# Altium project 2026MM.PrjPcb (part 8 of 10)
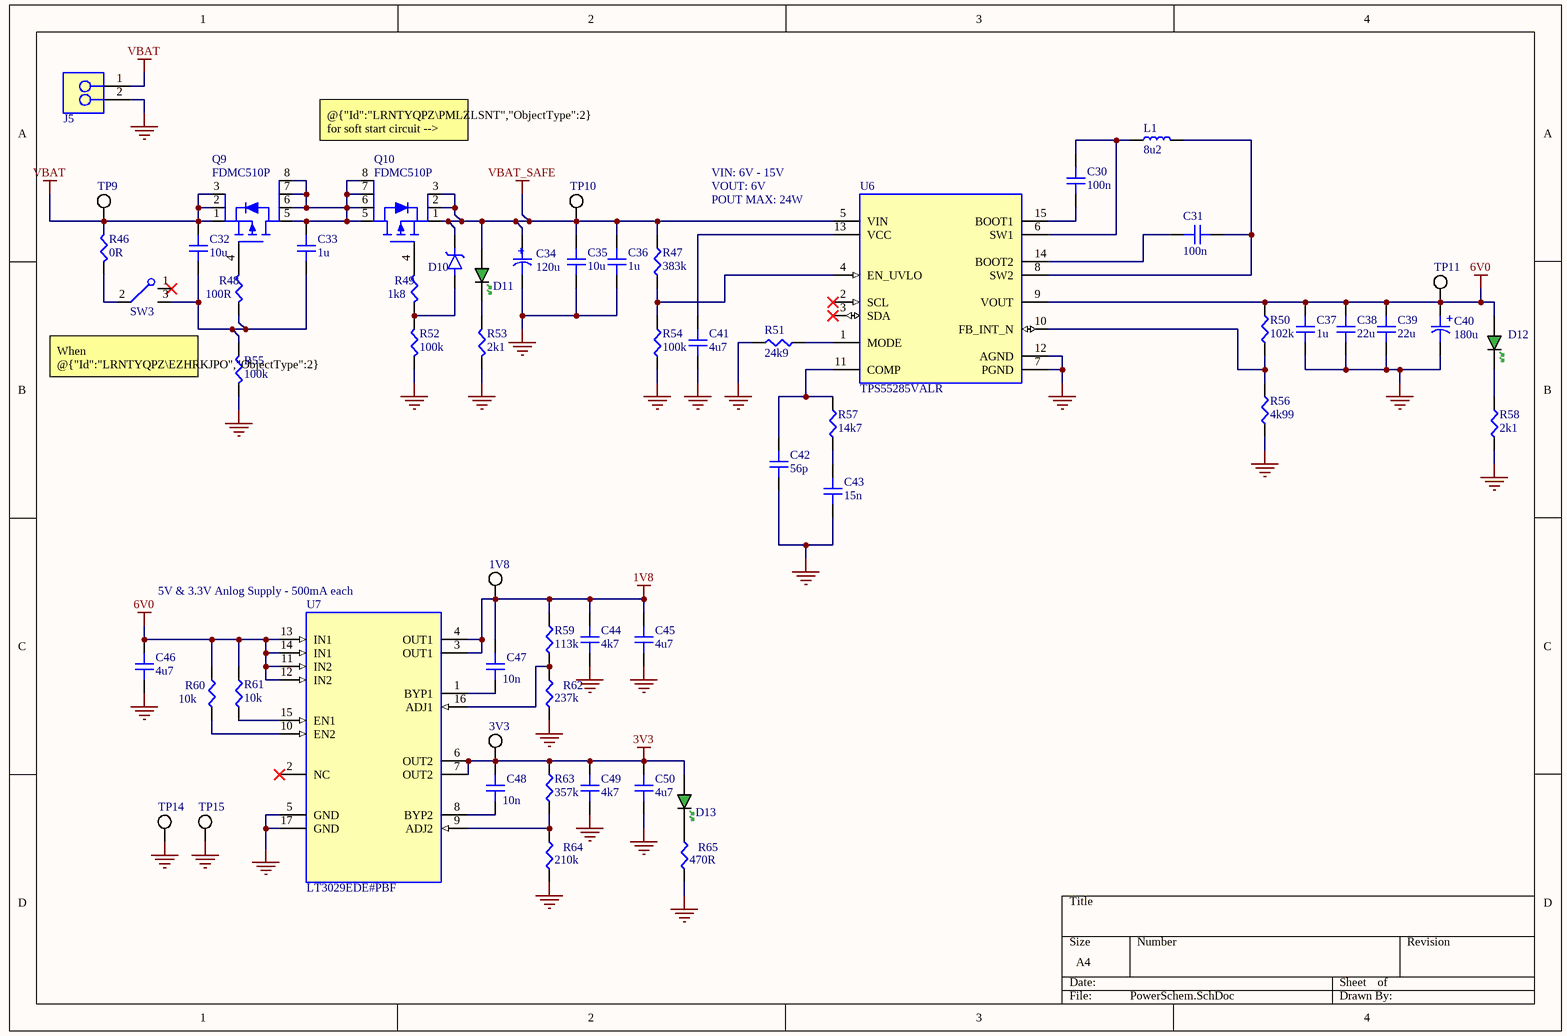
[diagram p8: PowerSchem.SchDoc]

## Sheet PowerSchem.SchDoc (continued)

### Library data of the parts (continued)
Q9 Q10 = PMOS: Single P-Channel 20 V 17 mOhm 116 nC 41 W PowerTrench SMT Mosfet - MLP-3.3x3.3; Manufacturer: onsemi; Manufacturer Lifecycle Status: ACTIVE; Continuous Drain Current (ID): 12A; Drain to Source Breakdown Voltage: -20V; Drain to Source Resistance: 8mΩ; Fall Time: 170ns; Gate to Source Voltage (Vgs): 8V; Input Capacitance: 7.86nF; Max Junction Temperature (Tj): 150°C; Max Power Dissipation: 41W; Min Breakdown Voltage: 20V; Number of Channels: 1; Power Dissipation: 2.3W; Rise Time: 34ns; Threshold Voltage: -500mV; Turn-Off Delay Time: 338ns; Turn-On Delay Time: 15ns; Supplier: Newark; Supplier Part Number: 55T6319; Manufacturer Part Number: FDMC510P; RoHS: Compliant; Category: MOSFETs; Stock: 2627; Pricing: 5=2.73, 10=1.88, 25=1.69, 50=1.49, 100=1.3, 250=1.19, 500=1.08, 1000=1.05 (USD); China RoHS: Compliant; Contact Plating: Gold; Drain to Source Voltage (Vdss): -20V; Element Configuration: Single; Height: 800µm; Length: 3.3mm; Lifecycle Status: Production; Max Operating Temperature: 150°C; Min Operating Temperature: -55°C; Mounting Technology: Surface Mount; Number of Elements: 1; Pins: 8; Number of Terminals: 5; Radiation Hardening: No; Rds On Max: 8mΩ; REACH SVHC: Yes; Schedule B: 8541290080, 8541290080|8541290080|8541290080|8541290080|8541290080; Weight: 165.33333mg; Width: 3.3mm; ComponentLink1URL: https://datasheet.octopart.com:443/FDMC510P-onsemi-datasheet-165728270.pdf?src-supplier=JRH+Electronics; ComponentLink1Description: https://datasheet.octopart.com:443/FDMC510P-onsemi-datasheet-165728270.pdf?src-supplier=JRH+Electronics; ComponentLink2URL: https://datasheet.octopart.com:443/FDMC510P-onsemi-datasheet-180959644.pdf?src-supplier=IHS; ComponentLink2Description: https://datasheet.octopart.com:443/FDMC510P-onsemi-datasheet-180959644.pdf?src-supplier=IHS; ComponentLink3URL: https://datasheet.octopart.com:443/FDMC510P-Fairchild-Semiconductor-datasheet-182289896.pdf?src-supplier=IHS; ComponentLink3Description: https://datasheet.octopart.com:443/FDMC510P-Fairchild-Semiconductor-datasheet-182289896.pdf?src-supplier=IHS; ComponentLink4URL: https://sigma.octopart.com:443/138897669/technical_drawing/onsemi-FDMC510P.pdf?src-supplier=Upverter; ComponentLink4Description: https://sigma.octopart.com:443/138897669/technical_drawing/onsemi-FDMC510P.pdf?src-supplier=Upverter; ComponentLink5URL: https://datasheet.octopart.com:443/FDMC510P-ON-Semiconductor-datasheet-98394445.pdf?src-supplier=Master+Electronics; ComponentLink5Description: https://datasheet.octopart.com:443/FDMC510P-ON-Semiconductor-datasheet-98394445.pdf?src-supplier=Master+Electronics; ComponentLink6URL: https://datasheet.octopart.com:443/FDMC510P-ON-Semiconductor-datasheet-85476435.pdf?src-supplier=onsemi; ComponentLink6Description: https://datasheet.octopart.com:443/FDMC510P-ON-Semiconductor-datasheet-85476435.pdf?src-supplier=onsemi; ComponentLink7URL: https://datasheet.octopart.com:443/FDMC510P-ON-Semiconductor-datasheet-86693097.pdf?src-supplier=onsemi; ComponentLink7Description: https://datasheet.octopart.com:443/FDMC510P-ON-Semiconductor-datasheet-86693097.pdf?src-supplier=onsemi; ComponentLink8URL: https://datasheet.octopart.com:443/FDMC510P-Fairchild-Semiconductor-datasheet-10853929.pdf?src-supplier=element14+APAC; ComponentLink8Description: https://datasheet.octopart.com:443/FDMC510P-Fairchild-Semiconductor-datasheet-10853929.pdf?src-supplier=element14+APAC; ComponentLink9URL: https://datasheet.octopart.com:443/FDMC510P-ON-Semiconductor-datasheet-86688170.pdf?src-supplier=element14+APAC; ComponentLink9Description: https://datasheet.octopart.com:443/FDMC510P-ON-Semiconductor-datasheet-86688170.pdf?src-supplier=element14+APAC; ComponentLink10URL: https://datasheet.octopart.com:443/FDMC510P-Fairchild-Semiconductor-datasheet-33026367.pdf?src-supplier=element14+APAC; ComponentLink10Description: https://datasheet.octopart.com:443/FDMC510P-Fairchild-Semiconductor-datasheet-33026367.pdf?src-supplier=element14+APAC; ComponentLink11URL: https://datasheet.octopart.com:443/FDMC510P-onsemi-datasheet-181958840.pdf?src-supplier=Newark; ComponentLink11Description: https://datasheet.octopart.com:443/FDMC510P-onsemi-datasheet-181958840.pdf?src-supplier=Newark; ComponentLink12URL: https://datasheet.octopart.com:443/FDMC510P-Fairchild-Semiconductor-datasheet-21199293.pdf?src-supplier=Newark; ComponentLink12Description: https://datasheet.octopart.com:443/FDMC510P-Fairchild-Semiconductor-datasheet-21199293.pdf?src-supplier=Newark; ComponentLink13URL: https://datasheet.octopart.com:443/FDMC510P-Fairchild-Semiconductor-datasheet-32852807.pdf?src-supplier=Newark; ComponentLink13Description: https://datasheet.octopart.com:443/FDMC510P-Fairchild-Semiconductor-datasheet-32852807.pdf?src-supplier=Newark; ComponentLink14URL: https://datasheet.octopart.com:443/FDMC510P-ON-Semiconductor-datasheet-33132503.pdf?src-supplier=Fairchild+Semiconductor; ComponentLink14Description: https://datasheet.octopart.com:443/FDMC510P-ON-Semiconductor-datasheet-33132503.pdf?src-supplier=Fairchild+Semiconductor; ComponentLink15URL: https://sigma.octopart.com:443/33130028/technical_drawing/Fairchild-Semiconductor-FDMC510P.pdf?src-supplier=Fairchild+Semiconductor; ComponentLink15Description: https://sigma.octopart.com:443/33130028/technical_drawing/Fairchild-Semiconductor-FDMC510P.pdf?src-supplier=Fairchild+Semiconductor; ComponentLink16URL: https://sigma.octopart.com:443/17347435/technical_drawing/Fairchild-Semiconductor-FDMC510P.pdf?src-supplier=Fairchild+Semiconductor; ComponentLink16Description: https://sigma.octopart.com:443/17347435/technical_drawing/Fairchild-Semiconductor-FDMC510P.pdf?src-supplier=Fairchild+Semiconductor; ComponentLink17URL: https://datasheet.octopart.com:443/FDMC510P-Fairchild-Semiconductor-datasheet-31665617.pdf?src-supplier=Farnell; ComponentLink17Description: https://datasheet.octopart.com:443/FDMC510P-Fairchild-Semiconductor-datasheet-31665617.pdf?src-supplier=Farnell; ComponentLink18URL: https://datasheet.octopart.com:443/FDMC510P-Fairchild-Semiconductor-datasheet-11793458.pdf?src-supplier=Arrow+Electronics; ComponentLink18Description: https://datasheet.octopart.com:443/FDMC510P-Fairchild-Semiconductor-datasheet-11793458.pdf?src-supplier=Arrow+Electronics; ComponentLink19URL: https://datasheet.octopart.com:443/FDMC510P-ON-Semiconductor-datasheet-130079718.pdf?src-supplier=TME; ComponentLink19Description: https://datasheet.octopart.com:443/FDMC510P-ON-Semiconductor-datasheet-130079718.pdf?src-supplier=TME; ComponentLink20URL: https://datasheet.octopart.com:443/FDMC510P-Fairchild-Semiconductor-datasheet-14042252.pdf?src-supplier=iiiC; ComponentLink20Description: https://datasheet.octopart.com:443/FDMC510P-Fairchild-Semiconductor-datasheet-14042252.pdf?src-supplier=iiiC; ComponentLink21URL: http://sigma.octopart.com:80/150608879/rohs_statement/ON-Semiconductor-FDMC510P.pdf?src-supplier=Compliance+Statements; ComponentLink21Description: http://sigma.octopart.com:80/150608879/rohs_statement/ON-Semiconductor-FDMC510P.pdf?src-supplier=Compliance+Statements; ComponentLink22URL: http://sigma.octopart.com:80/17347465/reach_statement/Fairchild-Semiconductor-FDMC510P.pdf?src-supplier=Compliance+Statements; ComponentLink22Description: http://sigma.octopart.com:80/17347465/reach_statement/Fairchild-Semiconductor-FDMC510P.pdf?src-supplier=Compliance+Statements; ComponentLink23URL: http://sigma.octopart.com:80/17347469/materials_sheet/Fairchild-Semiconductor-FDMC510P.pdf?src-supplier=Compliance+Statements; ComponentLink23Description: http://sigma.octopart.com:80/17347469/materials_sheet/Fairchild-Semiconductor-FDMC510P.pdf?src-supplier=Compliance+Statements; ComponentLink24URL: http://sigma.octopart.com:80/33132635/reach_statement/Fairchild-Semiconductor-FDMC510P.pdf?src-supplier=Compliance+Statements; ComponentLink24Description: http://sigma.octopart.com:80/33132635/reach_statement/Fairchild-Semiconductor-FDMC510P.pdf?src-supplier=Compliance+Statements; ComponentLink25URL: http://sigma.octopart.com:80/33132647/materials_sheet/Fairchild-Semiconductor-FDMC510P.pdf?src-supplier=Compliance+Statements; ComponentLink25Description: http://sigma.octopart.com:80/33132647/materials_sheet/Fairchild-Semiconductor-FDMC510P.pdf?src-supplier=Compliance+Statements; ComponentLink26URL: http://sigma.octopart.com:80/reach_statement/ON-Semiconductor-company-79.pdf?src-supplier=Compliance+Statements; ComponentLink26Description: http://sigma.octopart.com:80/reach_statement/ON-Semiconductor-company-79.pdf?src-supplier=Compliance+Statements; ComponentLink27URL: http://sigma.octopart.com:80/reach_statement/Fairchild-Semiconductor-company-9.pdf?src-supplier=Compliance+Statements; ComponentLink27Description: http://sigma.octopart.com:80/reach_statement/Fairchild-Semiconductor-company-9.pdf?src-supplier=Compliance+Statements; ComponentLink28URL: http://sigma.octopart.com:80/rohs_statement/Fairchild-Semiconductor-company-10.pdf?src-supplier=Compliance+Statements; ComponentLink28Description: http://sigma.octopart.com:80/rohs_statement/Fairchild-Semiconductor-company-10.pdf?src-supplier=Compliance+Statements; ComponentLink29URL: http://sigma.octopart.com:80/rohs_statement/Fairchild-Semiconductor-company-11.pdf?src-supplier=Compliance+Statements; ComponentLink29Description: http://sigma.octopart.com:80/rohs_statement/Fairchild-Semiconductor-company-11.pdf?src-supplier=Compliance+Statements; ComponentLink30URL: https://octopart.com:443/opatz8j6/c1?t=dVssBGCTMjMDuZ8LzfI9h-sCjmCv5fC98FaG_P8I69eWOln85ap1aE-Ca2bz-RAyN2ZXqR6przDzMpCE58kh4AJDHYDyR3EpiomfbbDlH4jXtrkNWaDVizcOiV7jmULHPFoYVJAH90Rx5QNsievqdckXrXmLYAFVonklUYXppuEPic276FdRbjc2zYru_rs1cSu4-6y02IakjByRH9wH7ES2BWSk7eA1NwGWHKQ1bgEFufbeIPnBRlFJ2r5lIWj5r9jzPV4HLpWTYrqG4y-Gwam281sC2yDMtqQo1L_Ous2VjI3XkGPB-LvVfIQiWMMSNC83OfJzuEA_eoibmu3f00fgEoipcTa800Bljw&src-supplier=Compliance+Statements; ComponentLink30Description: https://octopart.com:443/opatz8j6/c1?t=dVssBGCTMjMDuZ8LzfI9h-sCjmCv5fC98FaG_P8I69eWOln85ap1aE-Ca2bz-RAyN2ZXqR6przDzMpCE58kh4AJDHYDyR3EpiomfbbDlH4jXtrkNWaDVizcOiV7jmULHPFoYVJAH90Rx5QNsievqdckXrXmLYAFVonklUYXppuEPic276FdRbjc2zYru_rs1cSu4-6y02IakjByRH9wH7ES2BWSk7eA1NwGWHKQ1bgEFufbeIPnBRlFJ2r5lIWj5r9jzPV4HLpWTYrqG4y-Gwam281sC2yDMtqQo1L_Ous2VjI3XkGPB-LvVfIQiWMMSNC83OfJzuEA_eoibmu3f00fgEoipcTa800Bljw&src-supplier=Compliance+Statements; ComponentLink31URL: https://octopart.com:443/opatz8j6/c1?t=ur27FYyO6V6hX1TgMYtmm8OD-P2le7yUFyviZdag842a6RB6B76-HyNzzxTkr3DykXScWdfYvd_d4AuEORiF2Eg5UPIMXJzw-g1ysG48Pa3n2ew7j1Jol16yAbQYlqZfOOVG36Xa2ealcgWEbMkHsy38FXKcIwpMWyneeip2g_VuQ4pe9Hu33BoPR6pAOFWuZDzNMrc4ZUXwNbDIilaAB7qhgoqT1IlrvMfexiSRB7D8_MN69XK-sqE8U5E0iED-b6_M4yP2hG4xxVdhUblIYtUmVsbOoEUCM3MC6YkG10UWi5iEcPtPDOKVNw0cpfVpxKYIrSRS-220T8_vfQM613JpenGVWuGw0El1&src-supplier=Compliance+Statements; ComponentLink31Description: https://octopart.com:443/opatz8j6/c1?t=ur27FYyO6V6hX1TgMYtmm8OD-P2le7yUFyviZdag842a6RB6B76-HyNzzxTkr3DykXScWdfYvd_d4AuEORiF2Eg5UPIMXJzw-g1ysG48Pa3n2ew7j1Jol16yAbQYlqZfOOVG36Xa2ealcgWEbMkHsy38FXKcIwpMWyneeip2g_VuQ4pe9Hu33BoPR6pAOFWuZDzNMrc4ZUXwNbDIilaAB7qhgoqT1IlrvMfexiSRB7D8_MN69XK-sqE8U5E0iED-b6_M4yP2hG4xxVdhUblIYtUmVsbOoEUCM3MC6YkG10UWi5iEcPtPDOKVNw0cpfVpxKYIrSRS-220T8_vfQM613JpenGVWuGw0El1&src-supplier=Compliance+Statements; Supplier 1: Newark; Supplier Part Number 1: FDMC510P; Country of Origin: Thailand; Export Control Classification Number (ECCN) Code: EAR99; Introduction Date: 2010-05-19; ComponentLink32URL: https://octopart.com:443/opatz8j6/c1?t=RML8NUxsOD3zxQbLCG8hisxkZIMWN814d7TbImpILMRVzn674V32XSskTU4OpmrXR_F4c8XdCQhWM49aP13ECACXcxqgWHE-E8PlMICW5HechuJMk2pSs0e9rMmYu0YD-EiUNcRS0SwVh-bt5aJmjImXp9rfv5BjJi5oB7pKW6ijneoujgUEyPkNEhjf8nC2laKbe16OQmqFg_QBC8wyWOOSBmsIk6z1ll_is2cHUHx9HwPKEn_pOxfF08i0Zq1-2eWXrF4Fn-y5i3i5XSXygnw-VVhNUAEKeHZUfp77q22Ac852uuosVrhPrj7IIUecCxlsDZn6FyzrV2cOLnTUKkxkBaPb3k2QDqjkJg&src-supplier=Compliance+Statements; ComponentLink32Description: https://octopart.com:443/opatz8j6/c1?t=RML8NUxsOD3zxQbLCG8hisxkZIMWN814d7TbImpILMRVzn674V32XSskTU4OpmrXR_F4c8XdCQhWM49aP13ECACXcxqgWHE-E8PlMICW5HechuJMk2pSs0e9rMmYu0YD-EiUNcRS0SwVh-bt5aJmjImXp9rfv5BjJi5oB7pKW6ijneoujgUEyPkNEhjf8nC2laKbe16OQmqFg_QBC8wyWOOSBmsIk6z1ll_is2cHUHx9HwPKEn_pOxfF08i0Zq1-2eWXrF4Fn-y5i3i5XSXygnw-VVhNUAEKeHZUfp77q22Ac852uuosVrhPrj7IIUecCxlsDZn6FyzrV2cOLnTUKkxkBaPb3k2QDqjkJg&src-supplier=Compliance+Statements; ComponentLink33URL: https://octopart.com:443/opatz8j6/c1?t=ufmlkAmUS6MZ-17ePBarHbc93ydNq8eGZQ0uTxoTrkmQ1MRSwF9KwTFjFjAgo9HcFrtzUSnf1P65j3Lz7eGF6jydxYNGOEIsCBDujU0FsXFPnBJbOTeyY6oOK-w7douSgfiJmsVPw2G3MJ_qKT8i5rYQ4u-soB1E1yDKj1eKh3LO1RwFyk7iXLS9VOkvFPCESk-9Ns8-OSraXB-xNepBnO_lfd9606VBexn1tXLvRynW--i4ax44CvNnqKbAZxH82NP1VAut5zwmhlO-hYedaCK05bTQ7OkheYpxIzA2mC7ELajepPR_fPo26NaJh9t4Sgtxl9-c4nO_U8dely3pgMVGsf9i0vV64Hwf&src-supplier=Compliance+Statements; ComponentLink33Description: https://octopart.com:443/opatz8j6/c1?t=ufmlkAmUS6MZ-17ePBarHbc93ydNq8eGZQ0uTxoTrkmQ1MRSwF9KwTFjFjAgo9HcFrtzUSnf1P65j3Lz7eGF6jydxYNGOEIsCBDujU0FsXFPnBJbOTeyY6oOK-w7douSgfiJmsVPw2G3MJ_qKT8i5rYQ4u-soB1E1yDKj1eKh3LO1RwFyk7iXLS9VOkvFPCESk-9Ns8-OSraXB-xNepBnO_lfd9606VBexn1tXLvRynW--i4ax44CvNnqKbAZxH82NP1VAut5zwmhlO-hYedaCK05bTQ7OkheYpxIzA2mC7ELajepPR_fPo26NaJh9t4Sgtxl9-c4nO_U8dely3pgMVGsf9i0vV64Hwf&src-supplier=Compliance+Statements
R46 = RES: GENERAL PURPOSE CHIP RESISTOR Metal Glaze/thick Film, 0.1W, 0ohm, Surface Mount, 0603; Manufacturer: Yageo Group; Manufacturer Part Number: RC0603JR-070RL; Power Rating: 100mW; Temperature Coefficient: 200ppm/°C; Tolerance: 1%; Voltage Rating: 50V; Value: 0R; Supplier 1: Avnet; Supplier Part Number 1: RC0603JR-070RL; RoHS: Compliant; Category: Chip SMD Resistors; Stock: 1835000; Pricing: 5000=0.00139, 10000=0.00135, 20000=0.00131, 40000=0.00129, 80000=0.00126 (USD); Case/Package: 0603; Case Code (Imperial): 0603; China RoHS: Non-Compliant; Composition: Thick Film; Contact Plating: Tin; Country of Origin: Mainland China, Taiwan; Depth: 800µm; Export Control Classification Number (ECCN) Code: EAR99; Height: 450µm; Harmonized Tariff Schedule (HTS) Code: 8533.21.00.30; Introduction Date: 2001-06-08; Lead Free: Lead Free; Length: 1.6mm; Lifecycle Status: Production; Max Operating Temperature: 155°C; Military Standard: Not; Min Operating Temperature: -55°C; Mounting Technology: Surface Mount; Pins: 2; Number of Terminals: 2; Packaging: Cut Tape; Radiation Hardening: No; REACH SVHC: Yes; Termination: SMD/SMT; Voltage Rating (DC): 50V; Width: 800µm; ComponentLink1URL: https://datasheet.octopart.com:443/RC0603JR-070RL-Yageo-datasheet-182189538.pdf?src-supplier=IHS; ComponentLink1Description: https://datasheet.octopart.com:443/RC0603JR-070RL-Yageo-datasheet-182189538.pdf?src-supplier=IHS; ComponentLink2URL: https://datasheet.octopart.com:443/RC0603JR-070RL-Yageo-datasheet-8328172.pdf?src-supplier=element14+APAC; ComponentLink2Description: https://datasheet.octopart.com:443/RC0603JR-070RL-Yageo-datasheet-8328172.pdf?src-supplier=element14+APAC; ComponentLink3URL: https://datasheet.octopart.com:443/RC0603JR-070RL-Yageo-datasheet-17842380.pdf?src-supplier=element14+APAC; ComponentLink3Description: https://datasheet.octopart.com:443/RC0603JR-070RL-Yageo-datasheet-17842380.pdf?src-supplier=element14+APAC; ComponentLink4URL: https://datasheet.octopart.com:443/RC0603JR-070RL-Yageo-Group-datasheet-190305687.pdf?src-supplier=Newark; ComponentLink4Description: https://datasheet.octopart.com:443/RC0603JR-070RL-Yageo-Group-datasheet-190305687.pdf?src-supplier=Newark; ComponentLink5URL: https://datasheet.octopart.com:443/RC0603JR-070RL-Yageo-datasheet-12596169.pdf?src-supplier=Newark; ComponentLink5Description: https://datasheet.octopart.com:443/RC0603JR-070RL-Yageo-datasheet-12596169.pdf?src-supplier=Newark; ComponentLink6URL: https://datasheet.octopart.com:443/RC0603JR-070RL-Yageo-datasheet-34211833.pdf?src-supplier=Newark; ComponentLink6Description: https://datasheet.octopart.com:443/RC0603JR-070RL-Yageo-datasheet-34211833.pdf?src-supplier=Newark; ComponentLink7URL: https://datasheet.octopart.com:443/RC0603JR-070RL-Yageo-datasheet-62067350.pdf?src-supplier=Farnell; ComponentLink7Description: https://datasheet.octopart.com:443/RC0603JR-070RL-Yageo-datasheet-62067350.pdf?src-supplier=Farnell; ComponentLink8URL: https://datasheet.octopart.com:443/RC0603JR-070RL-Yageo-datasheet-15599030.pdf?src-supplier=Future+Electronics; ComponentLink8Description: https://datasheet.octopart.com:443/RC0603JR-070RL-Yageo-datasheet-15599030.pdf?src-supplier=Future+Electronics; ComponentLink9URL: https://datasheet.octopart.com:443/RC0603JR-070RL-Yageo-Group-datasheet-176638170.pdf?src-supplier=Future+Electronics; ComponentLink9Description: https://datasheet.octopart.com:443/RC0603JR-070RL-Yageo-Group-datasheet-176638170.pdf?src-supplier=Future+Electronics; ComponentLink10URL: https://datasheet.octopart.com:443/RC0603JR-070RL-Yageo-datasheet-164759695.pdf?src-supplier=Future+Electronics; ComponentLink10Description: https://datasheet.octopart.com:443/RC0603JR-070RL-Yageo-datasheet-164759695.pdf?src-supplier=Future+Electronics; ComponentLink11URL: https://datasheet.octopart.com:443/RC0603JR-070RL-Yageo-datasheet-137700087.pdf?src-supplier=Future+Electronics; ComponentLink11Description: https://datasheet.octopart.com:443/RC0603JR-070RL-Yageo-datasheet-137700087.pdf?src-supplier=Future+Electronics; ComponentLink12URL: https://datasheet.octopart.com:443/RC0603JR-070RL-Yageo-datasheet-27584510.pdf?src-supplier=Future+Electronics; ComponentLink12Description: https://datasheet.octopart.com:443/RC0603JR-070RL-Yageo-datasheet-27584510.pdf?src-supplier=Future+Electronics; ComponentLink13URL: https://datasheet.octopart.com:443/RC0603JR-070RL-Yageo-datasheet-503470.pdf?src-supplier=Future+Electronics; ComponentLink13Description: https://datasheet.octopart.com:443/RC0603JR-070RL-Yageo-datasheet-503470.pdf?src-supplier=Future+Electronics; ComponentLink14URL: https://datasheet.octopart.com:443/RC0603JR-070RL-Yageo-datasheet-79472498.pdf?src-supplier=Megastar; ComponentLink14Description: https://datasheet.octopart.com:443/RC0603JR-070RL-Yageo-datasheet-79472498.pdf?src-supplier=Megastar; ComponentLink15URL: https://datasheet.octopart.com/RC0603JR-070RL-Yageo-datasheet-73766026.pdf; ComponentLink15Description: https://datasheet.octopart.com/RC0603JR-070RL-Yageo-datasheet-73766026.pdf; ComponentLink16URL: https://datasheet.octopart.com:443/RC0603JR-070RL-Yageo-datasheet-5393049.pdf?src-supplier=element14; ComponentLink16Description: https://datasheet.octopart.com:443/RC0603JR-070RL-Yageo-datasheet-5393049.pdf?src-supplier=element14; ComponentLink17URL: https://datasheet.octopart.com:443/RC0603JR-070RL-Yageo-datasheet-118562.pdf?src-supplier=DigiKey; ComponentLink17Description: https://datasheet.octopart.com:443/RC0603JR-070RL-Yageo-datasheet-118562.pdf?src-supplier=DigiKey; ComponentLink18URL: http://sigma.octopart.com:80/conflict_mineral_statement/Yageo-company-3.pdf?src-supplier=Compliance+Statements; ComponentLink18Description: http://sigma.octopart.com:80/conflict_mineral_statement/Yageo-company-3.pdf?src-supplier=Compliance+Statements; ComponentLink19URL: http://sigma.octopart.com:80/rohs_statement/Yageo-company-2.pdf?src-supplier=Compliance+Statements; ComponentLink19Description: http://sigma.octopart.com:80/rohs_statement/Yageo-company-2.pdf?src-supplier=Compliance+Statements
R47 = RES: Res Thick Film 0603 383K Ohm 1% 0.1W(1/10W) ±100ppm/C Pad SMD T/R; Manufacturer: Yageo Group; Manufacturer Part Number: RC0603FR-07383KL; Max Power Dissipation: 100mW; Temperature Coefficient: 100ppm/°C; Voltage Rating: 75V; Voltage Rating (DC): 50V; Value: 383k; Supplier 1: Avnet; Supplier Part Number 1: 49AK2050; RoHS: Compliant; Category: Chip SMD Resistors; Stock: 1151; Pricing: 1=0.103, 25=0.006, 100=0.006 (USD); Case/Package: 0603; Case Code (Imperial): 0603; China RoHS: Non-Compliant; Composition: Thick Film; Country of Origin: Mainland China, Taiwan; Depth: 800µm; Export Control Classification Number (ECCN) Code: EAR99; Features: Moisture Resistant; Height: 450µm; Harmonized Tariff Schedule (HTS) Code: 8533.21.00.30; Introduction Date: 2004-09-22; Lead Free: Lead Free; Length: 1.6mm; Lifecycle Status: Production; Max Operating Temperature: 155°C; Military Standard: Not; Min Operating Temperature: -55°C; Mounting Technology: Surface Mount; Number of Terminals: 2; Number of Terminations: 2; Packaging: Tape & Reel; Power Rating: 100mW; REACH SVHC: Yes; Schedule B: 8533210045, 8533210045|8533210045, 8533210045|8533210045|8533210045, 8533210045|8533210045|8533210045|8533210045; Termination: SMD/SMT; Tolerance: 1%; Weight: 2.012816mg; Width: 800µm; Working Voltage: 75V; ComponentLink1URL: https://datasheet.octopart.com:443/RC0603FR-07383KL-Yageo-datasheet-175887523.pdf?src-supplier=Newark; ComponentLink1Description: https://datasheet.octopart.com:443/RC0603FR-07383KL-Yageo-datasheet-175887523.pdf?src-supplier=Newark; ComponentLink2URL: https://datasheet.octopart.com:443/RC0603FR-07383KL-Yageo-datasheet-103092701.pdf?src-supplier=Upverter; ComponentLink2Description: https://datasheet.octopart.com:443/RC0603FR-07383KL-Yageo-datasheet-103092701.pdf?src-supplier=Upverter; ComponentLink3URL: https://datasheet.octopart.com:443/RC0603FR-07383KL-Yageo-Group-datasheet-190305687.pdf?src-supplier=Future+Electronics; ComponentLink3Description: https://datasheet.octopart.com:443/RC0603FR-07383KL-Yageo-Group-datasheet-190305687.pdf?src-supplier=Future+Electronics; ComponentLink4URL: https://datasheet.octopart.com:443/RC0603FR-07383KL-Yageo-datasheet-164759695.pdf?src-supplier=Future+Electronics; ComponentLink4Description: https://datasheet.octopart.com:443/RC0603FR-07383KL-Yageo-datasheet-164759695.pdf?src-supplier=Future+Electronics; ComponentLink5URL: https://datasheet.octopart.com:443/RC0603FR-07383KL-Yageo-datasheet-137700087.pdf?src-supplier=Future+Electronics; ComponentLink5Description: https://datasheet.octopart.com:443/RC0603FR-07383KL-Yageo-datasheet-137700087.pdf?src-supplier=Future+Electronics; ComponentLink6URL: https://datasheet.octopart.com:443/RC0603FR-07383KL-Yageo-datasheet-27584510.pdf?src-supplier=Future+Electronics; ComponentLink6Description: https://datasheet.octopart.com:443/RC0603FR-07383KL-Yageo-datasheet-27584510.pdf?src-supplier=Future+Electronics; ComponentLink7URL: https://datasheet.octopart.com:443/RC0603FR-07383KL-Yageo-datasheet-15599030.pdf?src-supplier=Future+Electronics; ComponentLink7Description: https://datasheet.octopart.com:443/RC0603FR-07383KL-Yageo-datasheet-15599030.pdf?src-supplier=Future+Electronics; ComponentLink8URL: https://datasheet.octopart.com:443/RC0603FR-07383KL-Yageo-datasheet-12596169.pdf?src-supplier=Future+Electronics; ComponentLink8Description: https://datasheet.octopart.com:443/RC0603FR-07383KL-Yageo-datasheet-12596169.pdf?src-supplier=Future+Electronics; ComponentLink9URL: https://datasheet.octopart.com:443/RC0603FR-07383KL-Yageo-datasheet-8328172.pdf?src-supplier=Future+Electronics; ComponentLink9Description: https://datasheet.octopart.com:443/RC0603FR-07383KL-Yageo-datasheet-8328172.pdf?src-supplier=Future+Electronics; ComponentLink10URL: https://datasheet.octopart.com:443/RC0603FR-07383KL-Yageo-Group-datasheet-189192902.pdf?src-supplier=TME; ComponentLink10Description: https://datasheet.octopart.com:443/RC0603FR-07383KL-Yageo-Group-datasheet-189192902.pdf?src-supplier=TME; ComponentLink11URL: https://datasheet.octopart.com:443/RC0603FR-07383KL-Yageo-Group-datasheet-176638170.pdf?src-supplier=TME; ComponentLink11Description: https://datasheet.octopart.com:443/RC0603FR-07383KL-Yageo-Group-datasheet-176638170.pdf?src-supplier=TME; ComponentLink12URL: https://datasheet.octopart.com/RC0603FR-07383KL-Yageo-datasheet-73766026.pdf; ComponentLink12Description: https://datasheet.octopart.com/RC0603FR-07383KL-Yageo-datasheet-73766026.pdf; ComponentLink13URL: https://datasheet.octopart.com:443/RC0603FR-07383KL-Yageo-datasheet-118562.pdf?src-supplier=DigiKey; ComponentLink13Description: https://datasheet.octopart.com:443/RC0603FR-07383KL-Yageo-datasheet-118562.pdf?src-supplier=DigiKey; ComponentLink14URL: http://sigma.octopart.com:80/conflict_mineral_statement/Yageo-company-3.pdf?src-supplier=Compliance+Statements; ComponentLink14Description: http://sigma.octopart.com:80/conflict_mineral_statement/Yageo-company-3.pdf?src-supplier=Compliance+Statements; ComponentLink15URL: http://sigma.octopart.com:80/rohs_statement/Yageo-company-2.pdf?src-supplier=Compliance+Statements; ComponentLink15Description: http://sigma.octopart.com:80/rohs_statement/Yageo-company-2.pdf?src-supplier=Compliance+Statements
R48 = RES: Yageo RC0603FR-07100RL 0603 SMD Resistor 100 Ohm thin film chip resistor; Manufacturer: Yageo Group; Power Rating: 100mW; Temperature Coefficient: 100ppm/°C; Tolerance: 1%; Voltage Rating: 75V; Voltage Rating (DC): 50V; Value: 100R; Supplier 1: Avnet; Supplier Part Number 1: RC0603FR-07100RL; Manufacturer Part Number: RC0603FR-07100RL; RoHS: Compliant; Category: Chip SMD Resistors; Stock: 2960000; Pricing: 5000=0.00137, 10000=0.00137, 20000=0.00136, 40000=0.00135, 80000=0.00134 (USD); Case/Package: 0603; Case Code (Imperial): 0603; Case Code (Metric): 0603; China RoHS: Non-Compliant; Composition: Thick Film; Contact Plating: Tin; Depth: 800µm; Height: 450µm; Lead Free: Lead Free; Length: 1.6mm; Lifecycle Status: Production; Max Operating Temperature: 155°C; Military Standard: Not; Min Operating Temperature: -55°C; Mounting Technology: Surface Mount; Pins: 2; Number of Terminals: 2; Packaging: Cut Tape (CT); Radiation Hardening: No; REACH SVHC: Yes; Schedule B: 8533210045, 8533210045|8533210045|8533210045|8533210045|8533210045|8533210045|8533210045|8533210045|8533210045|8533210045|8533210045|8533210045|8533210045|8533210045|8533210045|8533210045|8533210045|8533210045|8533210045|8533210045|8533210045|8533210045|8533210045|85; Termination: SMD/SMT; Width: 800µm; Working Voltage: 75V; ComponentLink1URL: https://datasheet.octopart.com:443/RC0603FR-07100RL-Yageo-datasheet-175887523.pdf?src-supplier=IHS; ComponentLink1Description: https://datasheet.octopart.com:443/RC0603FR-07100RL-Yageo-datasheet-175887523.pdf?src-supplier=IHS; ComponentLink2URL: https://datasheet.octopart.com:443/RC0603FR-07100RL-Yageo-datasheet-8328172.pdf?src-supplier=Newark; ComponentLink2Description: https://datasheet.octopart.com:443/RC0603FR-07100RL-Yageo-datasheet-8328172.pdf?src-supplier=Newark; ComponentLink3URL: https://datasheet.octopart.com:443/RC0603FR-07100RL-Yageo-datasheet-34211833.pdf?src-supplier=Newark; ComponentLink3Description: https://datasheet.octopart.com:443/RC0603FR-07100RL-Yageo-datasheet-34211833.pdf?src-supplier=Newark; ComponentLink4URL: https://datasheet.octopart.com:443/RC0603FR-07100RL-Yageo-datasheet-103092701.pdf?src-supplier=Upverter; ComponentLink4Description: https://datasheet.octopart.com:443/RC0603FR-07100RL-Yageo-datasheet-103092701.pdf?src-supplier=Upverter; ComponentLink5URL: https://datasheet.octopart.com:443/RC0603FR-07100RL-Yageo-datasheet-62067350.pdf?src-supplier=element14+APAC; ComponentLink5Description: https://datasheet.octopart.com:443/RC0603FR-07100RL-Yageo-datasheet-62067350.pdf?src-supplier=element14+APAC; ComponentLink6URL: https://datasheet.octopart.com:443/RC0603FR-07100RL-Yageo-datasheet-17842380.pdf?src-supplier=element14+APAC; ComponentLink6Description: https://datasheet.octopart.com:443/RC0603FR-07100RL-Yageo-datasheet-17842380.pdf?src-supplier=element14+APAC; ComponentLink7URL: https://datasheet.octopart.com:443/RC0603FR-07100RL-Yageo-datasheet-12596169.pdf?src-supplier=Future+Electronics; ComponentLink7Description: https://datasheet.octopart.com:443/RC0603FR-07100RL-Yageo-datasheet-12596169.pdf?src-supplier=Future+Electronics; ComponentLink8URL: https://datasheet.octopart.com:443/RC0603FR-07100RL-Yageo-Group-datasheet-176638170.pdf?src-supplier=Future+Electronics; ComponentLink8Description: https://datasheet.octopart.com:443/RC0603FR-07100RL-Yageo-Group-datasheet-176638170.pdf?src-supplier=Future+Electronics; ComponentLink9URL: https://datasheet.octopart.com:443/RC0603FR-07100RL-Yageo-datasheet-164759695.pdf?src-supplier=Future+Electronics; ComponentLink9Description: https://datasheet.octopart.com:443/RC0603FR-07100RL-Yageo-datasheet-164759695.pdf?src-supplier=Future+Electronics; ComponentLink10URL: https://datasheet.octopart.com:443/RC0603FR-07100RL-Yageo-datasheet-137700087.pdf?src-supplier=Future+Electronics; ComponentLink10Description: https://datasheet.octopart.com:443/RC0603FR-07100RL-Yageo-datasheet-137700087.pdf?src-supplier=Future+Electronics; ComponentLink11URL: https://datasheet.octopart.com:443/RC0603FR07100RL-Yageo-datasheet-27584510.pdf?src-supplier=Future+Electronics; ComponentLink11Description: https://datasheet.octopart.com:443/RC0603FR07100RL-Yageo-datasheet-27584510.pdf?src-supplier=Future+Electronics; ComponentLink12URL: https://datasheet.octopart.com:443/RC0603FR-07100RL-Yageo-datasheet-15599030.pdf?src-supplier=Future+Electronics; ComponentLink12Description: https://datasheet.octopart.com:443/RC0603FR-07100RL-Yageo-datasheet-15599030.pdf?src-supplier=Future+Electronics; ComponentLink13URL: https://datasheet.octopart.com:443/RC0603FR-07100RL-Yageo-datasheet-8324193.pdf?src-supplier=Future+Electronics; ComponentLink13Description: https://datasheet.octopart.com:443/RC0603FR-07100RL-Yageo-datasheet-8324193.pdf?src-supplier=Future+Electronics; ComponentLink14URL: https://datasheet.octopart.com:443/RC0603FR-07100RL-Yageo-datasheet-79472498.pdf?src-supplier=Megastar; ComponentLink14Description: https://datasheet.octopart.com:443/RC0603FR-07100RL-Yageo-datasheet-79472498.pdf?src-supplier=Megastar; ComponentLink15URL: https://datasheet.octopart.com/RC0603FR-07100RL-Yageo-datasheet-73766026.pdf; ComponentLink15Description: https://datasheet.octopart.com/RC0603FR-07100RL-Yageo-datasheet-73766026.pdf; ComponentLink16URL: https://datasheet.octopart.com:443/RC0603FR-07100RL-Yageo-datasheet-13691069.pdf?src-supplier=Farnell; ComponentLink16Description: https://datasheet.octopart.com:443/RC0603FR-07100RL-Yageo-datasheet-13691069.pdf?src-supplier=Farnell; ComponentLink17URL: https://datasheet.octopart.com:443/RC0603FR-07100RL-Yageo-datasheet-118562.pdf?src-supplier=DigiKey; ComponentLink17Description: https://datasheet.octopart.com:443/RC0603FR-07100RL-Yageo-datasheet-118562.pdf?src-supplier=DigiKey; ComponentLink18URL: http://sigma.octopart.com:80/conflict_mineral_statement/Yageo-company-3.pdf?src-supplier=Compliance+Statements; ComponentLink18Description: http://sigma.octopart.com:80/conflict_mineral_statement/Yageo-company-3.pdf?src-supplier=Compliance+Statements; ComponentLink19URL: http://sigma.octopart.com:80/rohs_statement/Yageo-company-2.pdf?src-supplier=Compliance+Statements; ComponentLink19Description: http://sigma.octopart.com:80/rohs_statement/Yageo-company-2.pdf?src-supplier=Compliance+Statements
R49 = RES: General Purpose Chip Resistors RC0603 Rohs Compliant | Res SMD 1.8K Ohm 1% 1/10W 0603; Manufacturer: Yageo Group; Manufacturer Part Number: RC0603FR-071K8L; Max Power Dissipation: 100mW; Temperature Coefficient: 100ppm/°C; Voltage Rating: 75V; Voltage Rating (AC): 50V; Value: 1k8; Supplier 1: Avnet; Supplier Part Number 1: RC0603FR-071K8L; RoHS: Compliant; Category: Chip SMD Resistors; Stock: 485000; Pricing: 5000=0.00137, 10000=0.00137, 20000=0.00136, 40000=0.00135, 80000=0.00134 (USD); Case/Package: 0603; Case Code (Imperial): 0603; China RoHS: Non-Compliant; Composition: Thick Film; Contact Plating: Tin; Depth: 800µm; Features: Moisture Resistant; Height: 450µm; Lead Free: Lead Free; Length: 1.6mm; Lifecycle Status: Production; Max Operating Temperature: 155°C; Military Standard: Not; Min Operating Temperature: -55°C; Mounting Technology: Surface Mount; Pins: 2; Number of Terminals: 2; Number of Terminations: 2; Packaging: Cut Tape; Power Rating: 100mW; Radiation Hardening: No; REACH SVHC: Yes; Schedule B: 8533210045, 8533210045|8533210045, 8533210045|8533210045|8533210045, 8533210045|8533210045|8533210045|8533210045; Termination: SMD/SMT; Tolerance: 1%; Voltage Rating (DC): 50V; Width: 800µm; Working Voltage: 75V; ComponentLink1URL: https://datasheet.octopart.com:443/RC0603FR-071K8L-Yageo-datasheet-175887523.pdf?src-supplier=IHS; ComponentLink1Description: https://datasheet.octopart.com:443/RC0603FR-071K8L-Yageo-datasheet-175887523.pdf?src-supplier=IHS; ComponentLink2URL: https://datasheet.octopart.com:443/RC0603FR-071K8L-Yageo-datasheet-141265859.pdf?src-supplier=Upverter; ComponentLink2Description: https://datasheet.octopart.com:443/RC0603FR-071K8L-Yageo-datasheet-141265859.pdf?src-supplier=Upverter; ComponentLink3URL: https://datasheet.octopart.com:443/RC0603FR-071K8L-Yageo-datasheet-103092701.pdf?src-supplier=Upverter; ComponentLink3Description: https://datasheet.octopart.com:443/RC0603FR-071K8L-Yageo-datasheet-103092701.pdf?src-supplier=Upverter; ComponentLink4URL: https://datasheet.octopart.com:443/RC0603FR-071K8L-Yageo-Group-datasheet-190305687.pdf?src-supplier=Future+Electronics; ComponentLink4Description: https://datasheet.octopart.com:443/RC0603FR-071K8L-Yageo-Group-datasheet-190305687.pdf?src-supplier=Future+Electronics; ComponentLink5URL: https://datasheet.octopart.com:443/RC0603FR-071K8L-Yageo-datasheet-164759695.pdf?src-supplier=Future+Electronics; ComponentLink5Description: https://datasheet.octopart.com:443/RC0603FR-071K8L-Yageo-datasheet-164759695.pdf?src-supplier=Future+Electronics; ComponentLink6URL: https://datasheet.octopart.com:443/RC0603FR-071K8L-Yageo-datasheet-137700087.pdf?src-supplier=Future+Electronics; ComponentLink6Description: https://datasheet.octopart.com:443/RC0603FR-071K8L-Yageo-datasheet-137700087.pdf?src-supplier=Future+Electronics; ComponentLink7URL: https://datasheet.octopart.com:443/RC0603FR-071K8L-Yageo-datasheet-27584510.pdf?src-supplier=Future+Electronics; ComponentLink7Description: https://datasheet.octopart.com:443/RC0603FR-071K8L-Yageo-datasheet-27584510.pdf?src-supplier=Future+Electronics; ComponentLink8URL: https://datasheet.octopart.com:443/RC0603FR-071K8L-Yageo-datasheet-15599030.pdf?src-supplier=Future+Electronics; ComponentLink8Description: https://datasheet.octopart.com:443/RC0603FR-071K8L-Yageo-datasheet-15599030.pdf?src-supplier=Future+Electronics; ComponentLink9URL: https://datasheet.octopart.com:443/RC0603FR-071K8L-Yageo-datasheet-12596169.pdf?src-supplier=Future+Electronics; ComponentLink9Description: https://datasheet.octopart.com:443/RC0603FR-071K8L-Yageo-datasheet-12596169.pdf?src-supplier=Future+Electronics; ComponentLink10URL: https://datasheet.octopart.com:443/RC0603FR-071K8L-Yageo-datasheet-8324193.pdf?src-supplier=Future+Electronics; ComponentLink10Description: https://datasheet.octopart.com:443/RC0603FR-071K8L-Yageo-datasheet-8324193.pdf?src-supplier=Future+Electronics; ComponentLink11URL: https://datasheet.octopart.com:443/RC0603FR-071K8L-Yageo-datasheet-8328172.pdf?src-supplier=Newark; ComponentLink11Description: https://datasheet.octopart.com:443/RC0603FR-071K8L-Yageo-datasheet-8328172.pdf?src-supplier=Newark; ComponentLink12URL: https://datasheet.octopart.com:443/RC0603FR-071K8L-Yageo-datasheet-62067350.pdf?src-supplier=Newark; ComponentLink12Description: https://datasheet.octopart.com:443/RC0603FR-071K8L-Yageo-datasheet-62067350.pdf?src-supplier=Newark; ComponentLink13URL: https://datasheet.octopart.com:443/RC0603FR-071K8L-Yageo-Group-datasheet-176638170.pdf?src-supplier=Newark; ComponentLink13Description: https://datasheet.octopart.com:443/RC0603FR-071K8L-Yageo-Group-datasheet-176638170.pdf?src-supplier=Newark; ComponentLink14URL: https://datasheet.octopart.com:443/RC0603FR-071K8L-Yageo-datasheet-34211833.pdf?src-supplier=Farnell; ComponentLink14Description: https://datasheet.octopart.com:443/RC0603FR-071K8L-Yageo-datasheet-34211833.pdf?src-supplier=Farnell; ComponentLink15URL: https://datasheet.octopart.com:443/RC0603FR-071K8L-Yageo-datasheet-148775077.pdf?src-supplier=TME; ComponentLink15Description: https://datasheet.octopart.com:443/RC0603FR-071K8L-Yageo-datasheet-148775077.pdf?src-supplier=TME; ComponentLink16URL: https://datasheet.octopart.com:443/RC0603FR-071K8L-Yageo-datasheet-79472498.pdf?src-supplier=Megastar; ComponentLink16Description: https://datasheet.octopart.com:443/RC0603FR-071K8L-Yageo-datasheet-79472498.pdf?src-supplier=Megastar; ComponentLink17URL: https://datasheet.octopart.com/RC0603FR-071K8L-Yageo-datasheet-73766026.pdf; ComponentLink17Description: https://datasheet.octopart.com/RC0603FR-071K8L-Yageo-datasheet-73766026.pdf; ComponentLink18URL: https://datasheet.octopart.com:443/RC0603FR-071K8L-Yageo-datasheet-30459151.pdf?src-supplier=Seeed+Studio; ComponentLink18Description: https://datasheet.octopart.com:443/RC0603FR-071K8L-Yageo-datasheet-30459151.pdf?src-supplier=Seeed+Studio; ComponentLink19URL: https://datasheet.octopart.com:443/RC0603FR-071K8L-Yageo-datasheet-118562.pdf?src-supplier=DigiKey; ComponentLink19Description: https://datasheet.octopart.com:443/RC0603FR-071K8L-Yageo-datasheet-118562.pdf?src-supplier=DigiKey; ComponentLink20URL: http://sigma.octopart.com:80/conflict_mineral_statement/Yageo-company-3.pdf?src-supplier=Compliance+Statements; ComponentLink20Description: http://sigma.octopart.com:80/conflict_mineral_statement/Yageo-company-3.pdf?src-supplier=Compliance+Statements; ComponentLink21URL: http://sigma.octopart.com:80/rohs_statement/Yageo-company-2.pdf?src-supplier=Compliance+Statements; ComponentLink21Description: http://sigma.octopart.com:80/rohs_statement/Yageo-company-2.pdf?src-supplier=Compliance+Statements
R50 = RES: 100mW Thin Film Resistor ±25ppm/℃ ±0.1% 102kΩ 0603 Chip Resistor - Surface Mount ROHS; Manufacturer: Yageo Group; Manufacturer Part Number: RT0603BRD07102KL; Temperature Coefficient: 25ppm/°C; Voltage Rating: 75V; Value: 102k; Supplier 1: Avnet; Supplier Part Number 1: 49AK4242; RoHS: Compliant; Category: Chip SMD Resistors; Stock: 3860; Pricing: 1=0.155 (USD); Case/Package: 0603; Case Code (Imperial): 0603; China RoHS: Non-Compliant; Composition: Thin Film; Country of Origin: Mainland China, Taiwan; Export Control Classification Number (ECCN) Code: EAR99; Features: Moisture Resistant; Height: 450µm; Harmonized Tariff Schedule (HTS) Code: 8533.21.00.30; Introduction Date: 2008-06-09; Lead Free: Lead Free; Length: 1.6mm; Lifecycle Status: Production; Max Operating Temperature: 155°C; Max Power Dissipation: 100mW; Min Operating Temperature: -55°C; Mounting Technology: Surface Mount; Number of Terminals: 2; Number of Terminations: 2; Power Rating: 100mW; REACH SVHC: Yes; Schedule B: 8533210045, 8533210045|8533210045, 8533210045|8533210045|8533210045, 8533210045|8533210045|8533210045|8533210045; Termination: SMD/SMT; Tolerance: 0.1%; Voltage Rating (DC): 75V; Weight: 2.012816mg; Width: 800µm; Working Voltage: 75V; ComponentLink1URL: https://datasheet.octopart.com:443/RT0603BRD07102KL-Yageo-datasheet-176402239.pdf?src-supplier=Future+Electronics; ComponentLink1Description: https://datasheet.octopart.com:443/RT0603BRD07102KL-Yageo-datasheet-176402239.pdf?src-supplier=Future+Electronics; ComponentLink2URL: https://datasheet.octopart.com:443/RT0603BRD07102KL-Yageo-datasheet-169971040.pdf?src-supplier=Future+Electronics; ComponentLink2Description: https://datasheet.octopart.com:443/RT0603BRD07102KL-Yageo-datasheet-169971040.pdf?src-supplier=Future+Electronics; ComponentLink3URL: https://datasheet.octopart.com:443/RT0603BRD07102KL-Yageo-datasheet-166250672.pdf?src-supplier=Future+Electronics; ComponentLink3Description: https://datasheet.octopart.com:443/RT0603BRD07102KL-Yageo-datasheet-166250672.pdf?src-supplier=Future+Electronics; ComponentLink4URL: https://datasheet.octopart.com:443/RT0603BRD07102KL-Yageo-datasheet-136673517.pdf?src-supplier=Future+Electronics; ComponentLink4Description: https://datasheet.octopart.com:443/RT0603BRD07102KL-Yageo-datasheet-136673517.pdf?src-supplier=Future+Electronics; ComponentLink5URL: https://datasheet.octopart.com:443/RT0603BRD07102KL-Yageo-datasheet-137700930.pdf?src-supplier=Future+Electronics; ComponentLink5Description: https://datasheet.octopart.com:443/RT0603BRD07102KL-Yageo-datasheet-137700930.pdf?src-supplier=Future+Electronics; ComponentLink6URL: https://datasheet.octopart.com:443/RT0603BRD07102KL-Yageo-datasheet-41589729.pdf?src-supplier=Future+Electronics; ComponentLink6Description: https://datasheet.octopart.com:443/RT0603BRD07102KL-Yageo-datasheet-41589729.pdf?src-supplier=Future+Electronics; ComponentLink7URL: https://datasheet.octopart.com:443/RT0603BRD07102KL-Yageo-datasheet-12594463.pdf?src-supplier=Future+Electronics; ComponentLink7Description: https://datasheet.octopart.com:443/RT0603BRD07102KL-Yageo-datasheet-12594463.pdf?src-supplier=Future+Electronics; ComponentLink8URL: https://datasheet.octopart.com:443/RT0603BRD07102KL-Yageo-datasheet-10915759.pdf?src-supplier=Future+Electronics; ComponentLink8Description: https://datasheet.octopart.com:443/RT0603BRD07102KL-Yageo-datasheet-10915759.pdf?src-supplier=Future+Electronics; ComponentLink9URL: https://datasheet.octopart.com:443/RT0603BRD07102KL-Yageo-datasheet-34924148.pdf?src-supplier=Future+Electronics; ComponentLink9Description: https://datasheet.octopart.com:443/RT0603BRD07102KL-Yageo-datasheet-34924148.pdf?src-supplier=Future+Electronics; ComponentLink10URL: https://datasheet.octopart.com:443/RT0603BRD07102KL-Yageo-datasheet-96443642.pdf?src-supplier=Upverter; ComponentLink10Description: https://datasheet.octopart.com:443/RT0603BRD07102KL-Yageo-datasheet-96443642.pdf?src-supplier=Upverter; ComponentLink11URL: https://datasheet.octopart.com:443/RT0603BRD07102KL-Yageo-Group-datasheet-141265893.pdf?src-supplier=ODG+(Origin+Data+Global); ComponentLink11Description: https://datasheet.octopart.com:443/RT0603BRD07102KL-Yageo-Group-datasheet-141265893.pdf?src-supplier=ODG+(Origin+Data+Global); ComponentLink12URL: https://datasheet.octopart.com/RT0603BRD07102KL-Yageo-datasheet-86813807.pdf; ComponentLink12Description: https://datasheet.octopart.com/RT0603BRD07102KL-Yageo-datasheet-86813807.pdf; ComponentLink13URL: http://sigma.octopart.com:80/conflict_mineral_statement/Yageo-company-3.pdf?src-supplier=Compliance+Statements; ComponentLink13Description: http://sigma.octopart.com:80/conflict_mineral_statement/Yageo-company-3.pdf?src-supplier=Compliance+Statements; ComponentLink14URL: http://sigma.octopart.com:80/rohs_statement/Yageo-company-2.pdf?src-supplier=Compliance+Statements; ComponentLink14Description: http://sigma.octopart.com:80/rohs_statement/Yageo-company-2.pdf?src-supplier=Compliance+Statements
R51 = RES: Res Thick Film 0603 24.9K Ohm 1% 1/10W |100ppm/|C SMD Punched Carrier T/R; Manufacturer: Panasonic; Manufacturer Part Number: ERJ-3EKF2492V; Manufacturer Lifecycle Status: ACTIVE; Part Series: Precision Thick Film Chip Resistors; Max Power Dissipation: 100mW; Temperature Coefficient: 100ppm/°C; Voltage Rating: 75V; Value: 24k9; Supplier 1: Verical; Supplier Part Number 1: ERJ-3EKF2492V; RoHS: Compliant; Category: Chip SMD Resistors; Stock: 145000; Pricing: 10000=0.0073, 25000=0.0066, 50000=0.0065, 100000=0.0064 (USD); Case/Package: 0603; Case Code (Imperial): 0603; China RoHS: Non-Compliant; Composition: Thick Film; Contact Plating: Tin; Depth: 800µm; Features: Automotive AEC-Q200; Height: 450µm; Lead Free: Lead Free; Length: 1.6mm; Lifecycle Status: Production; Max Operating Temperature: 155°C; Military Standard: Not; Min Operating Temperature: -55°C; Mounting Technology: Surface Mount; Number of Terminals: 2; Number of Terminations: 2; Packaging: Cut Tape; Power Rating: 100mW; Radiation Hardening: No; Ratings: AEC-Q200; REACH SVHC: Yes; Schedule B: 8533210045, 8533210045|8533210045|8533210045|8533210045|8533210045; Termination: SMD/SMT; Tolerance: 1%; Weight: 2.012816mg; Width: 800µm; Working Voltage: 75V; ComponentLink1URL: https://datasheet.octopart.com:443/ERJ3EKF2492V-Panasonic-datasheet-182147282.pdf?src-supplier=IHS; ComponentLink1Description: https://datasheet.octopart.com:443/ERJ3EKF2492V-Panasonic-datasheet-182147282.pdf?src-supplier=IHS; ComponentLink2URL: https://datasheet.octopart.com:443/ERJ-3EKF2492V-Panasonic-datasheet-82288794.pdf?src-supplier=Upverter; ComponentLink2Description: https://datasheet.octopart.com:443/ERJ-3EKF2492V-Panasonic-datasheet-82288794.pdf?src-supplier=Upverter; ComponentLink3URL: https://datasheet.octopart.com:443/ERJ-3EKF2492V-Panasonic-datasheet-13266541.pdf?src-supplier=RS+(Formerly+Allied+Electronics); ComponentLink3Description: https://datasheet.octopart.com:443/ERJ-3EKF2492V-Panasonic-datasheet-13266541.pdf?src-supplier=RS+(Formerly+Allied+Electronics); ComponentLink4URL: https://datasheet.octopart.com:443/ERJ-3EKF2492V-Panasonic-datasheet-10025800.pdf?src-supplier=Future+Electronics; ComponentLink4Description: https://datasheet.octopart.com:443/ERJ-3EKF2492V-Panasonic-datasheet-10025800.pdf?src-supplier=Future+Electronics; ComponentLink5URL: https://datasheet.octopart.com:443/ERJ-3EKF2492V-Panasonic-datasheet-8853621.pdf?src-supplier=Future+Electronics; ComponentLink5Description: https://datasheet.octopart.com:443/ERJ-3EKF2492V-Panasonic-datasheet-8853621.pdf?src-supplier=Future+Electronics; ComponentLink6URL: https://datasheet.octopart.com:443/ERJ-3EKF2492V-Panasonic-datasheet-5313456.pdf?src-supplier=Newark; ComponentLink6Description: https://datasheet.octopart.com:443/ERJ-3EKF2492V-Panasonic-datasheet-5313456.pdf?src-supplier=Newark; ComponentLink7URL: https://datasheet.octopart.com:443/ERJ-3EKF2492V-Panasonic-datasheet-48891056.pdf?src-supplier=Newark; ComponentLink7Description: https://datasheet.octopart.com:443/ERJ-3EKF2492V-Panasonic-datasheet-48891056.pdf?src-supplier=Newark; ComponentLink8URL: https://datasheet.octopart.com:443/ERJ3EKF2492V-Panasonic-datasheet-168681906.pdf?src-supplier=Newark; ComponentLink8Description: https://datasheet.octopart.com:443/ERJ3EKF2492V-Panasonic-datasheet-168681906.pdf?src-supplier=Newark; ComponentLink9URL: https://datasheet.octopart.com:443/ERJ-3EKF2492V-Panasonic-datasheet-136608610.pdf?src-supplier=Farnell; ComponentLink9Description: https://datasheet.octopart.com:443/ERJ-3EKF2492V-Panasonic-datasheet-136608610.pdf?src-supplier=Farnell; ComponentLink10URL: https://datasheet.octopart.com:443/ERJ-3EKF2492V-Panasonic---ECG-datasheet-15994758.pdf?src-supplier=Farnell; ComponentLink10Description: https://datasheet.octopart.com:443/ERJ-3EKF2492V-Panasonic---ECG-datasheet-15994758.pdf?src-supplier=Farnell; ComponentLink11URL: https://datasheet.octopart.com:443/ERJ-3EKF2492V-Panasonic-datasheet-154766169.pdf?src-supplier=Master+Electronics; ComponentLink11Description: https://datasheet.octopart.com:443/ERJ-3EKF2492V-Panasonic-datasheet-154766169.pdf?src-supplier=Master+Electronics; ComponentLink12URL: https://datasheet.octopart.com:443/ERJ3EKF2492V-Panasonic-datasheet-138819429.pdf?src-supplier=Burklin+Elektronik; ComponentLink12Description: https://datasheet.octopart.com:443/ERJ3EKF2492V-Panasonic-datasheet-138819429.pdf?src-supplier=Burklin+Elektronik; ComponentLink13URL: https://datasheet.octopart.com:443/ERJ3EKF2492V-Panasonic-datasheet-137230431.pdf?src-supplier=HQonline; ComponentLink13Description: https://datasheet.octopart.com:443/ERJ3EKF2492V-Panasonic-datasheet-137230431.pdf?src-supplier=HQonline; ComponentLink14URL: https://datasheet.octopart.com/ERJ-3EKF2492V-Panasonic-datasheet-78375410.pdf; ComponentLink14Description: https://datasheet.octopart.com/ERJ-3EKF2492V-Panasonic-datasheet-78375410.pdf; ComponentLink15URL: https://datasheet.octopart.com/Precision-Thick-Film-Chip-Resistors-Panasonic-datasheet-family-106.pdf; ComponentLink15Description: https://datasheet.octopart.com/Precision-Thick-Film-Chip-Resistors-Panasonic-datasheet-family-106.pdf; ComponentLink16URL: https://datasheet.octopart.com:443/ERJ-3EKF2492V-Panasonic-datasheet-11542829.pdf?src-supplier=Arrow+Electronics; ComponentLink16Description: https://datasheet.octopart.com:443/ERJ-3EKF2492V-Panasonic-datasheet-11542829.pdf?src-supplier=Arrow+Electronics; ComponentLink17URL: https://datasheet.octopart.com:443/ERJ-3EKF2492V-Panasonic-datasheet-7538305.pdf?src-supplier=Jameco; ComponentLink17Description: https://datasheet.octopart.com:443/ERJ-3EKF2492V-Panasonic-datasheet-7538305.pdf?src-supplier=Jameco; ComponentLink18URL: https://datasheet.octopart.com:443/ERJ-3EKF2492V-Panasonic-datasheet-118621.pdf?src-supplier=DigiKey; ComponentLink18Description: https://datasheet.octopart.com:443/ERJ-3EKF2492V-Panasonic-datasheet-118621.pdf?src-supplier=DigiKey; ComponentLink19URL: https://datasheet.octopart.com:443/ERJ-3EKF2492V-Panasonic-datasheet-41391857.pdf?src-supplier=Electro+Sonic; ComponentLink19Description: https://datasheet.octopart.com:443/ERJ-3EKF2492V-Panasonic-datasheet-41391857.pdf?src-supplier=Electro+Sonic